# EAGLE design Ringlight (EAGLE 9.6.2)
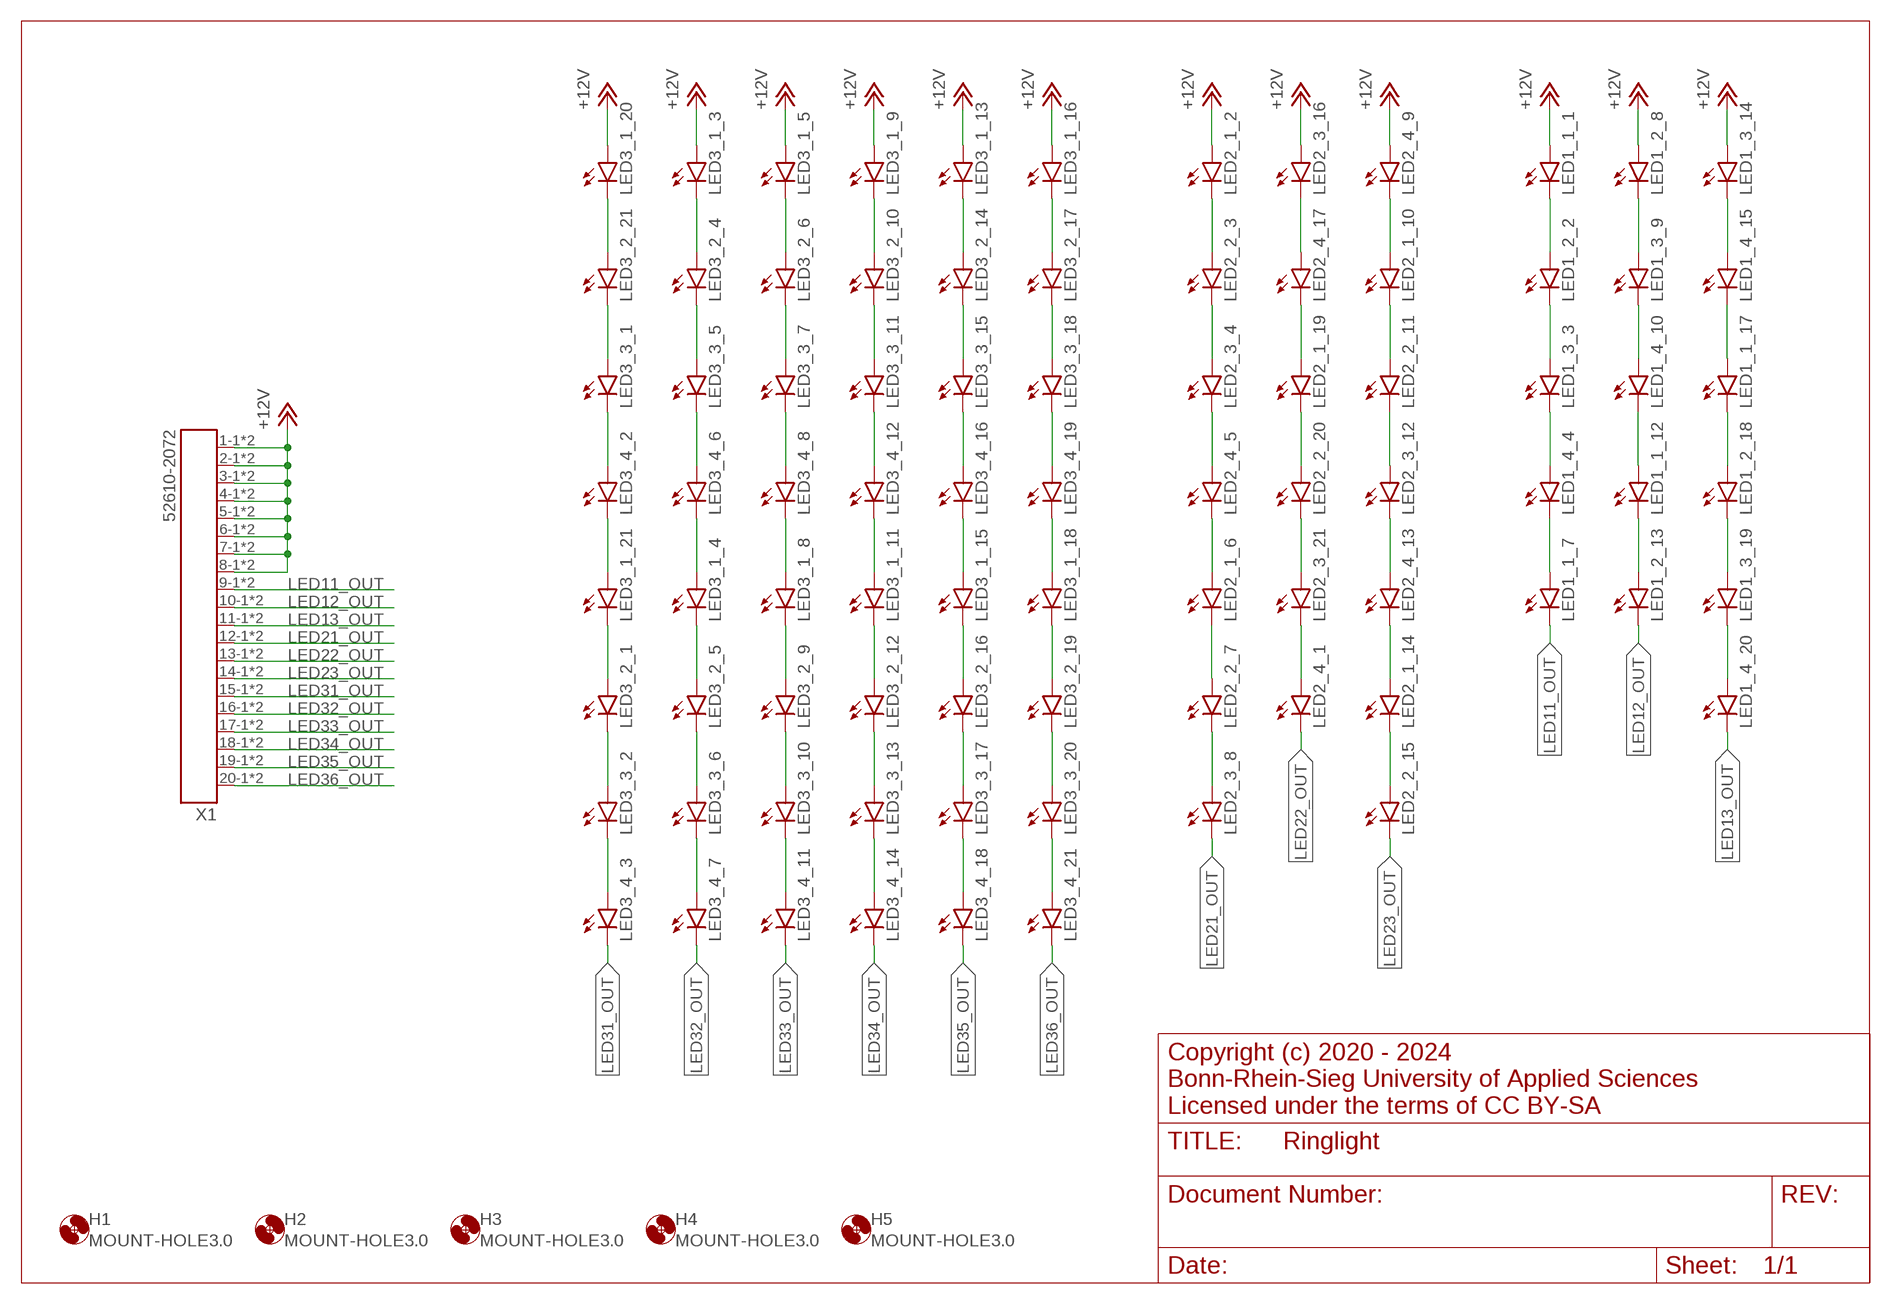
[diagram p0: schematic, sheet 1]

## Parts
H1  MOUNT-HOLE3.0  [3,0]
H2  MOUNT-HOLE3.0  [3,0]
H3  MOUNT-HOLE3.0  [3,0]
H4  MOUNT-HOLE3.0  [3,0]
H5  MOUNT-HOLE3.0  [3,0]
LED1_1_1  LED5MM  [LED5MM]
LED1_1_7  LED5MM  [LED5MM]
LED1_1_12  LED5MM  [LED5MM]
LED1_1_17  LED5MM  [LED5MM]
LED1_2_2  LED5MM  [LED5MM]
LED1_2_8  LED5MM  [LED5MM]
LED1_2_13  LED5MM  [LED5MM]
LED1_2_18  LED5MM  [LED5MM]
LED1_3_3  LED5MM  [LED5MM]
LED1_3_9  LED5MM  [LED5MM]
LED1_3_14  LED5MM  [LED5MM]
LED1_3_19  LED5MM  [LED5MM]
LED1_4_4  LED5MM  [LED5MM]
LED1_4_10  LED5MM  [LED5MM]
LED1_4_15  LED5MM  [LED5MM]
LED1_4_20  LED5MM  [LED5MM]
LED2_1_2  LED5MM  [LED5MM]
LED2_1_6  LED5MM  [LED5MM]
LED2_1_10  LED5MM  [LED5MM]
LED2_1_14  LED5MM  [LED5MM]
LED2_1_19  LED5MM  [LED5MM]
LED2_2_3  LED5MM  [LED5MM]
LED2_2_7  LED5MM  [LED5MM]
LED2_2_11  LED5MM  [LED5MM]
LED2_2_15  LED5MM  [LED5MM]
LED2_2_20  LED5MM  [LED5MM]
LED2_3_4  LED5MM  [LED5MM]
LED2_3_8  LED5MM  [LED5MM]
LED2_3_12  LED5MM  [LED5MM]
LED2_3_16  LED5MM  [LED5MM]
LED2_3_21  LED5MM  [LED5MM]
LED2_4_1  LED5MM  [LED5MM]
LED2_4_5  LED5MM  [LED5MM]
LED2_4_9  LED5MM  [LED5MM]
LED2_4_13  LED5MM  [LED5MM]
LED2_4_17  LED5MM  [LED5MM]
LED3_1_3  LED5MM  [LED5MM]
LED3_1_4  LED5MM  [LED5MM]
LED3_1_5  LED5MM  [LED5MM]
LED3_1_8  LED5MM  [LED5MM]
LED3_1_9  LED5MM  [LED5MM]
LED3_1_11  LED5MM  [LED5MM]
LED3_1_13  LED5MM  [LED5MM]
LED3_1_15  LED5MM  [LED5MM]
LED3_1_16  LED5MM  [LED5MM]
LED3_1_18  LED5MM  [LED5MM]
LED3_1_20  LED5MM  [LED5MM]
LED3_1_21  LED5MM  [LED5MM]
LED3_2_1  LED5MM  [LED5MM]
LED3_2_4  LED5MM  [LED5MM]
LED3_2_5  LED5MM  [LED5MM]
LED3_2_6  LED5MM  [LED5MM]
LED3_2_9  LED5MM  [LED5MM]
LED3_2_10  LED5MM  [LED5MM]
LED3_2_12  LED5MM  [LED5MM]
LED3_2_14  LED5MM  [LED5MM]
LED3_2_16  LED5MM  [LED5MM]
LED3_2_17  LED5MM  [LED5MM]
LED3_2_19  LED5MM  [LED5MM]
LED3_2_21  LED5MM  [LED5MM]
LED3_3_1  LED5MM  [LED5MM]
LED3_3_2  LED5MM  [LED5MM]
LED3_3_5  LED5MM  [LED5MM]
LED3_3_6  LED5MM  [LED5MM]
LED3_3_7  LED5MM  [LED5MM]
LED3_3_10  LED5MM  [LED5MM]
LED3_3_11  LED5MM  [LED5MM]
LED3_3_13  LED5MM  [LED5MM]
LED3_3_15  LED5MM  [LED5MM]
LED3_3_17  LED5MM  [LED5MM]
LED3_3_18  LED5MM  [LED5MM]
LED3_3_20  LED5MM  [LED5MM]
LED3_4_2  LED5MM  [LED5MM]
LED3_4_3  LED5MM  [LED5MM]
LED3_4_6  LED5MM  [LED5MM]
LED3_4_7  LED5MM  [LED5MM]
LED3_4_8  LED5MM  [LED5MM]
LED3_4_11  LED5MM  [LED5MM]
LED3_4_12  LED5MM  [LED5MM]
LED3_4_14  LED5MM  [LED5MM]
LED3_4_16  LED5MM  [LED5MM]
LED3_4_18  LED5MM  [LED5MM]
LED3_4_19  LED5MM  [LED5MM]
LED3_4_21  LED5MM  [LED5MM]
X1  52610-2072  [52610-2072]

## Nets
+12V: LED1_1_1.A LED1_2_8.A LED1_3_14.A LED2_1_2.A LED2_3_16.A LED2_4_9.A LED3_1_3.A LED3_1_5.A LED3_1_9.A LED3_1_13.A LED3_1_16.A LED3_1_20.A X1.1-1 X1.1-2 X1.2-1 X1.2-2 X1.3-1 X1.3-2 X1.4-1 X1.4-2 X1.5-1 X1.5-2 X1.6-1 X1.6-2 X1.7-1 X1.7-2 X1.8-1 X1.8-2
LED11_OUT: LED1_1_7.K(C) X1.9-1 X1.9-2
LED12_OUT: LED1_2_13.K(C) X1.10-1 X1.10-2
LED13_OUT: LED1_4_20.K(C) X1.11-1 X1.11-2
LED21_OUT: LED2_3_8.K(C) X1.12-1 X1.12-2
LED22_OUT: LED2_4_1.K(C) X1.13-1 X1.13-2
LED23_OUT: LED2_2_15.K(C) X1.14-1 X1.14-2
LED31_OUT: LED3_4_3.K(C) X1.15-1 X1.15-2
LED32_OUT: LED3_4_7.K(C) X1.16-1 X1.16-2
LED33_OUT: LED3_4_11.K(C) X1.17-1 X1.17-2
LED34_OUT: LED3_4_14.K(C) X1.18-1 X1.18-2
LED35_OUT: LED3_4_18.K(C) X1.19-1 X1.19-2
LED36_OUT: LED3_4_21.K(C) X1.20-1 X1.20-2
N$1: LED1_1_1.K(C) LED1_2_2.A
N$2: LED1_2_2.K(C) LED1_3_3.A
N$3: LED1_3_3.K(C) LED1_4_4.A
N$4: LED1_1_12.A LED1_4_10.K(C)
N$5: LED1_2_8.K(C) LED1_3_9.A
N$6: LED1_3_9.K(C) LED1_4_10.A
N$7: LED1_1_17.A LED1_4_15.K(C)
N$8: LED1_1_12.K(C) LED1_2_13.A
N$9: LED1_3_14.K(C) LED1_4_15.A
N$10: LED2_2_11.K(C) LED2_3_12.A
N$11: LED1_1_17.K(C) LED1_2_18.A
N$12: LED1_2_18.K(C) LED1_3_19.A
N$13: LED1_3_19.K(C) LED1_4_20.A
N$14: LED2_1_2.K(C) LED2_2_3.A
N$15: LED2_2_3.K(C) LED2_3_4.A
N$16: LED2_3_4.K(C) LED2_4_5.A
N$17: LED2_1_6.A LED2_4_5.K(C)
N$18: LED2_3_16.K(C) LED2_4_17.A
N$19: LED2_2_7.K(C) LED2_3_8.A
N$20: LED2_1_10.A LED2_4_9.K(C)
N$21: LED2_1_10.K(C) LED2_2_11.A
N$22: LED3_1_3.K(C) LED3_2_4.A
N$23: LED2_3_12.K(C) LED2_4_13.A
N$24: LED2_1_14.A LED2_4_13.K(C)
N$25: LED2_1_14.K(C) LED2_2_15.A
N$26: LED3_2_4.K(C) LED3_3_5.A
N$27: LED2_1_19.A LED2_4_17.K(C)
N$28: LED2_1_19.K(C) LED2_2_20.A
N$29: LED2_2_20.K(C) LED2_3_21.A
N$30: LED2_3_21.K(C) LED2_4_1.A
N$31: LED3_3_5.K(C) LED3_4_6.A
N$32: LED3_1_4.A LED3_4_6.K(C)
N$33: LED3_1_4.K(C) LED3_2_5.A
N$34: LED3_2_5.K(C) LED3_3_6.A
N$35: LED3_3_6.K(C) LED3_4_7.A
N$36: LED3_1_5.K(C) LED3_2_6.A
N$37: LED3_2_6.K(C) LED3_3_7.A
N$38: LED3_3_7.K(C) LED3_4_8.A
N$39: LED3_1_8.A LED3_4_8.K(C)
N$40: LED3_1_8.K(C) LED3_2_9.A
N$41: LED3_2_9.K(C) LED3_3_10.A
N$42: LED3_3_10.K(C) LED3_4_11.A
N$43: LED3_1_9.K(C) LED3_2_10.A
N$44: LED3_2_10.K(C) LED3_3_11.A
N$45: LED3_3_11.K(C) LED3_4_12.A
N$46: LED3_1_11.A LED3_4_12.K(C)
N$47: LED3_1_11.K(C) LED3_2_12.A
N$48: LED3_2_12.K(C) LED3_3_13.A
N$49: LED3_3_13.K(C) LED3_4_14.A
N$50: LED3_1_13.K(C) LED3_2_14.A
N$51: LED3_2_14.K(C) LED3_3_15.A
N$52: LED3_3_15.K(C) LED3_4_16.A
N$53: LED3_1_15.A LED3_4_16.K(C)
N$54: LED3_1_15.K(C) LED3_2_16.A
N$55: LED3_2_16.K(C) LED3_3_17.A
N$56: LED3_3_17.K(C) LED3_4_18.A
N$57: LED3_1_16.K(C) LED3_2_17.A
N$58: LED3_2_17.K(C) LED3_3_18.A
N$59: LED3_3_18.K(C) LED3_4_19.A
N$60: LED3_1_18.A LED3_4_19.K(C)
N$61: LED3_1_18.K(C) LED3_2_19.A
N$62: LED3_2_19.K(C) LED3_3_20.A
N$63: LED3_3_20.K(C) LED3_4_21.A
N$64: LED3_1_20.K(C) LED3_2_21.A
N$65: LED3_2_21.K(C) LED3_3_1.A
N$66: LED3_3_1.K(C) LED3_4_2.A
N$67: LED3_1_21.A LED3_4_2.K(C)
N$68: LED3_1_21.K(C) LED3_2_1.A
N$69: LED3_2_1.K(C) LED3_3_2.A
N$70: LED3_3_2.K(C) LED3_4_3.A
N$71: LED1_1_7.A LED1_4_4.K(C)
N$72: LED2_1_6.K(C) LED2_2_7.A

## Notes on the sheet
- Copyright (c) 2020 - 2024
  Bonn-Rhein-Sieg University of Applied Sciences
  Licensed under the terms of CC BY-SA

## Library data of the parts
H1-H5 = holes:MOUNT-HOLE: MOUNTING HOLE with drill center marker
LED1_1_1 LED1_1_7 LED1_1_12 LED1_1_17 LED1_2_2 LED1_2_8 LED1_2_13 LED1_2_18 LED1_3_3 LED1_3_9 LED1_3_14 LED1_3_19 LED1_4_4 LED1_4_10 LED1_4_15 LED1_4_20 LED2_1_2 LED2_1_6 LED2_1_10 LED2_1_14 LED2_1_19 LED2_2_3 LED2_2_7 LED2_2_11 LED2_2_15 LED2_2_20 LED2_3_4 LED2_3_8 LED2_3_12 LED2_3_16 LED2_3_21 LED2_4_1 LED2_4_5 LED2_4_9 LED2_4_13 LED2_4_17 LED3_1_3-LED3_1_5 LED3_1_8 LED3_1_9 LED3_1_11 LED3_1_13 LED3_1_15 LED3_1_16 LED3_1_18 LED3_1_20 LED3_1_21 LED3_2_1 LED3_2_4-LED3_2_6 LED3_2_9 LED3_2_10 LED3_2_12 LED3_2_14 LED3_2_16 LED3_2_17 LED3_2_19 LED3_2_21 LED3_3_1 LED3_3_2 LED3_3_5-LED3_3_7 LED3_3_10 LED3_3_11 LED3_3_13 LED3_3_15 LED3_3_17 LED3_3_18 LED3_3_20 LED3_4_2 LED3_4_3 LED3_4_6-LED3_4_8 LED3_4_11 LED3_4_12 LED3_4_14 LED3_4_16 LED3_4_18 LED3_4_19 LED3_4_21 = led:LED: LED OSRAM: - CHIPLED LG R971, LG N971, LY N971, LG Q971, LY Q971, LO R971, LY R971 LH N974, LH R974 LS Q976, LO Q976, LY Q976 LO Q996 - Hyper CHIPLED LW Q18S LB Q993, LB Q99A, LB R99A - SideLED LS A670, LO A670, LY A670, LG A670, LP A670 LB A673, LV A673, LT A673, LW A673 LH A674 LY A675 LS A676, LA A676, LO A676, LY A676, LW A676 LS A679, LY A679, LG A679 - Hyper Micro SIDELED® LS Y876, LA Y876, LO Y876, LY Y876 LT Y87S - SmartLED LW L88C, LW L88S LB L89C, LB L89S, LG L890 LS L89K, LO L89K, LY L89K LS L896, LA L896, LO L896, LY L896 - TOPLED LS T670, LO T670, LY T670, LG T670, LP T670 LSG T670, LSP T670, LSY T670, LOP T670, LYG T670 LG T671, LOG T671, LSG T671 LB T673, LV T673, LT T673, LW T673 LH T674 LS T676, LA T676, LO T676, LY T676, LB T676, LH T676, LSB T676, LW T676 LB T67C, LV T67C, LT T67C, LS T67K, LO T67K, LY T67K, LW E67C LS E67B, LA E67B, LO E67B, LY E67B, LB E67C, LV E67C, LT E67C LW T67C LS T679, LY T679, LG T679 LS T770, LO T770, LY T770, LG T770, LP T770 LB T773, LV T773, LT T773, LW T773 LH T774 LS E675, LA E675, LY E675, LS T675 LS T776, LA T776, LO T776, LY T776, LB T776 LHGB T686 LT T68C, LB T68C - Hyper Mini TOPLED® LB M676 - Mini TOPLED Santana® LG M470 LS M47K, LO M47K, LY M47K Source: http://www.osram.convergy.de LUXEON: - LUMILED® LXK2-PW12-R00, LXK2-PW12-S00, LXK2-PW14-U00, LXK2-PW14-V00 LXK2-PM12-R00, LXK2-PM12-S00, LXK2-PM14-U00 LXK2-PE12-Q00, LXK2-PE12-R00, LXK2-PE12-S00, LXK2-PE14-T00, LXK2-PE14-U00 LXK2-PB12-K00, LXK2-PB12-L00, LXK2-PB12-M00, LXK2-PB14-N00, LXK2-PB14-P00, LXK2-PB14-Q00 LXK2-PR12-L00, LXK2-PR12-M00, LXK2-PR14-Q00, LXK2-PR14-R00 LXK2-PD12-Q00, LXK2-PD12-R00, LXK2-PD12-S00 LXK2-PH12-R00, LXK2-PH12-S00 LXK2-PL12-P00, LXK2-PL12-Q00, LXK2-PL12-R00 Source: www.luxeon.com KINGBRIGHT: KA-3528ASYC Source: www.kingbright.com
X1 = Molex 52610-XX72:52610-2072

## Net classes
0 default: width 0.305 mm, clearance 0.305 mm

## Board
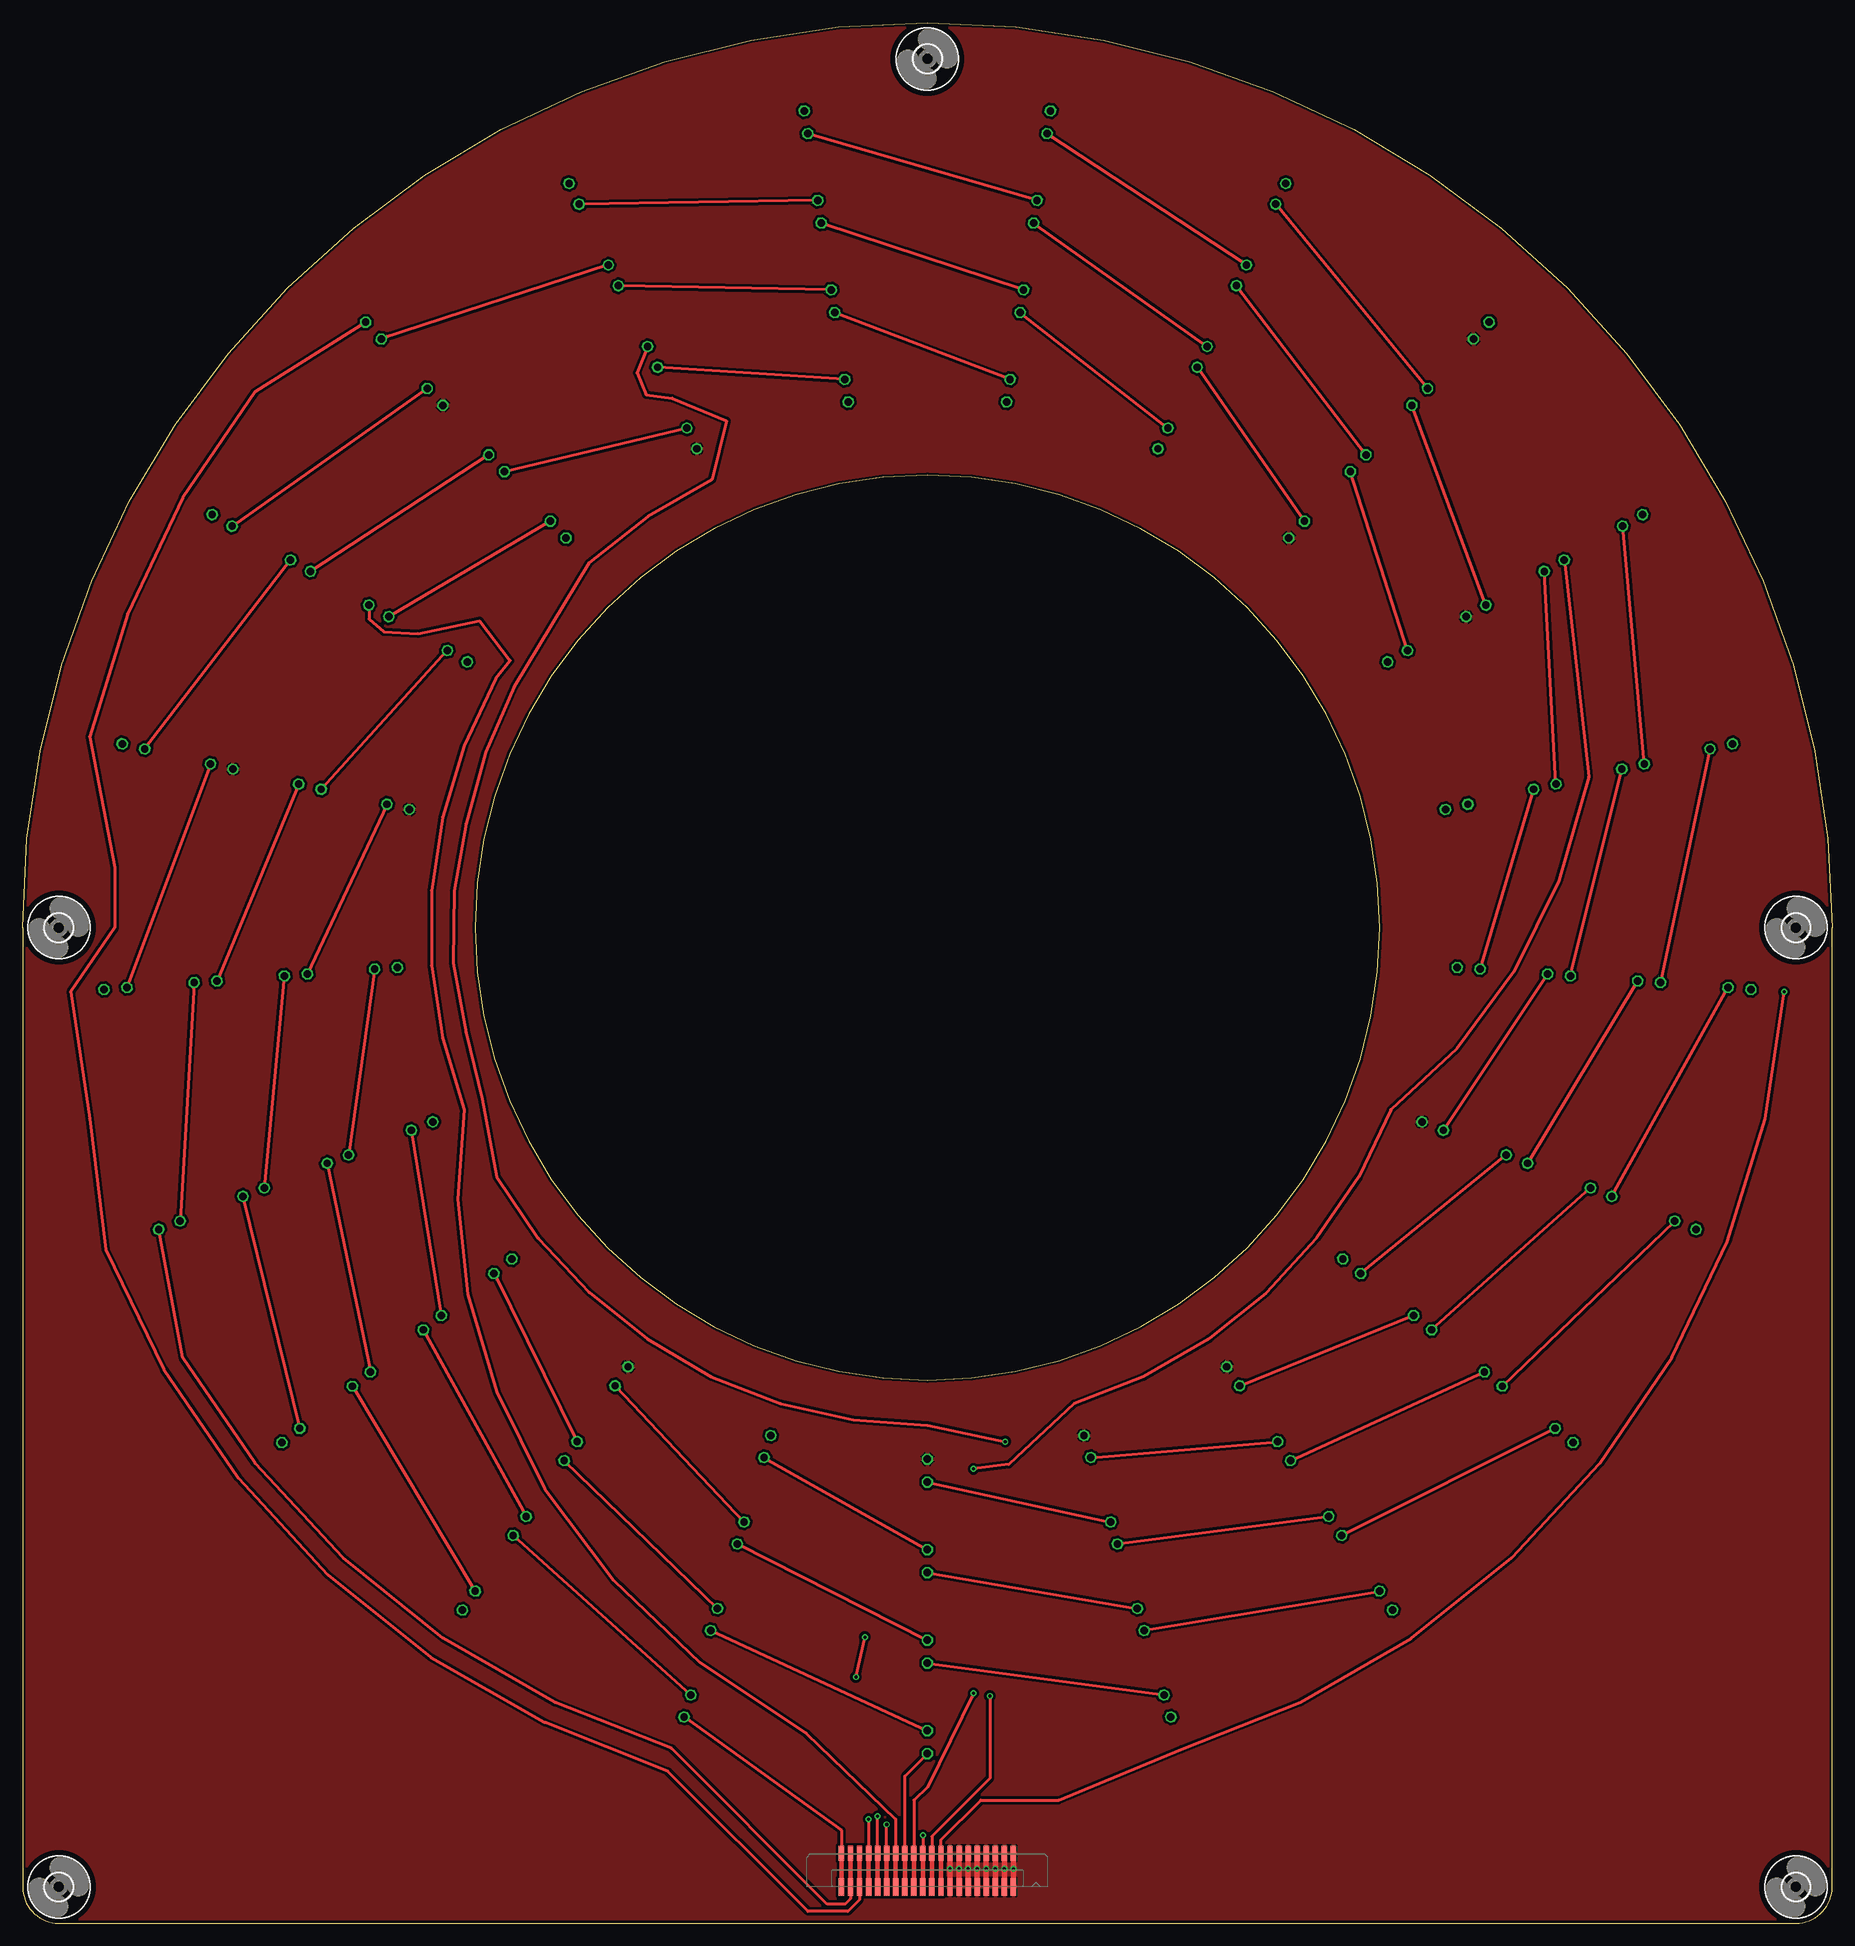
[diagram p1: board, top side]
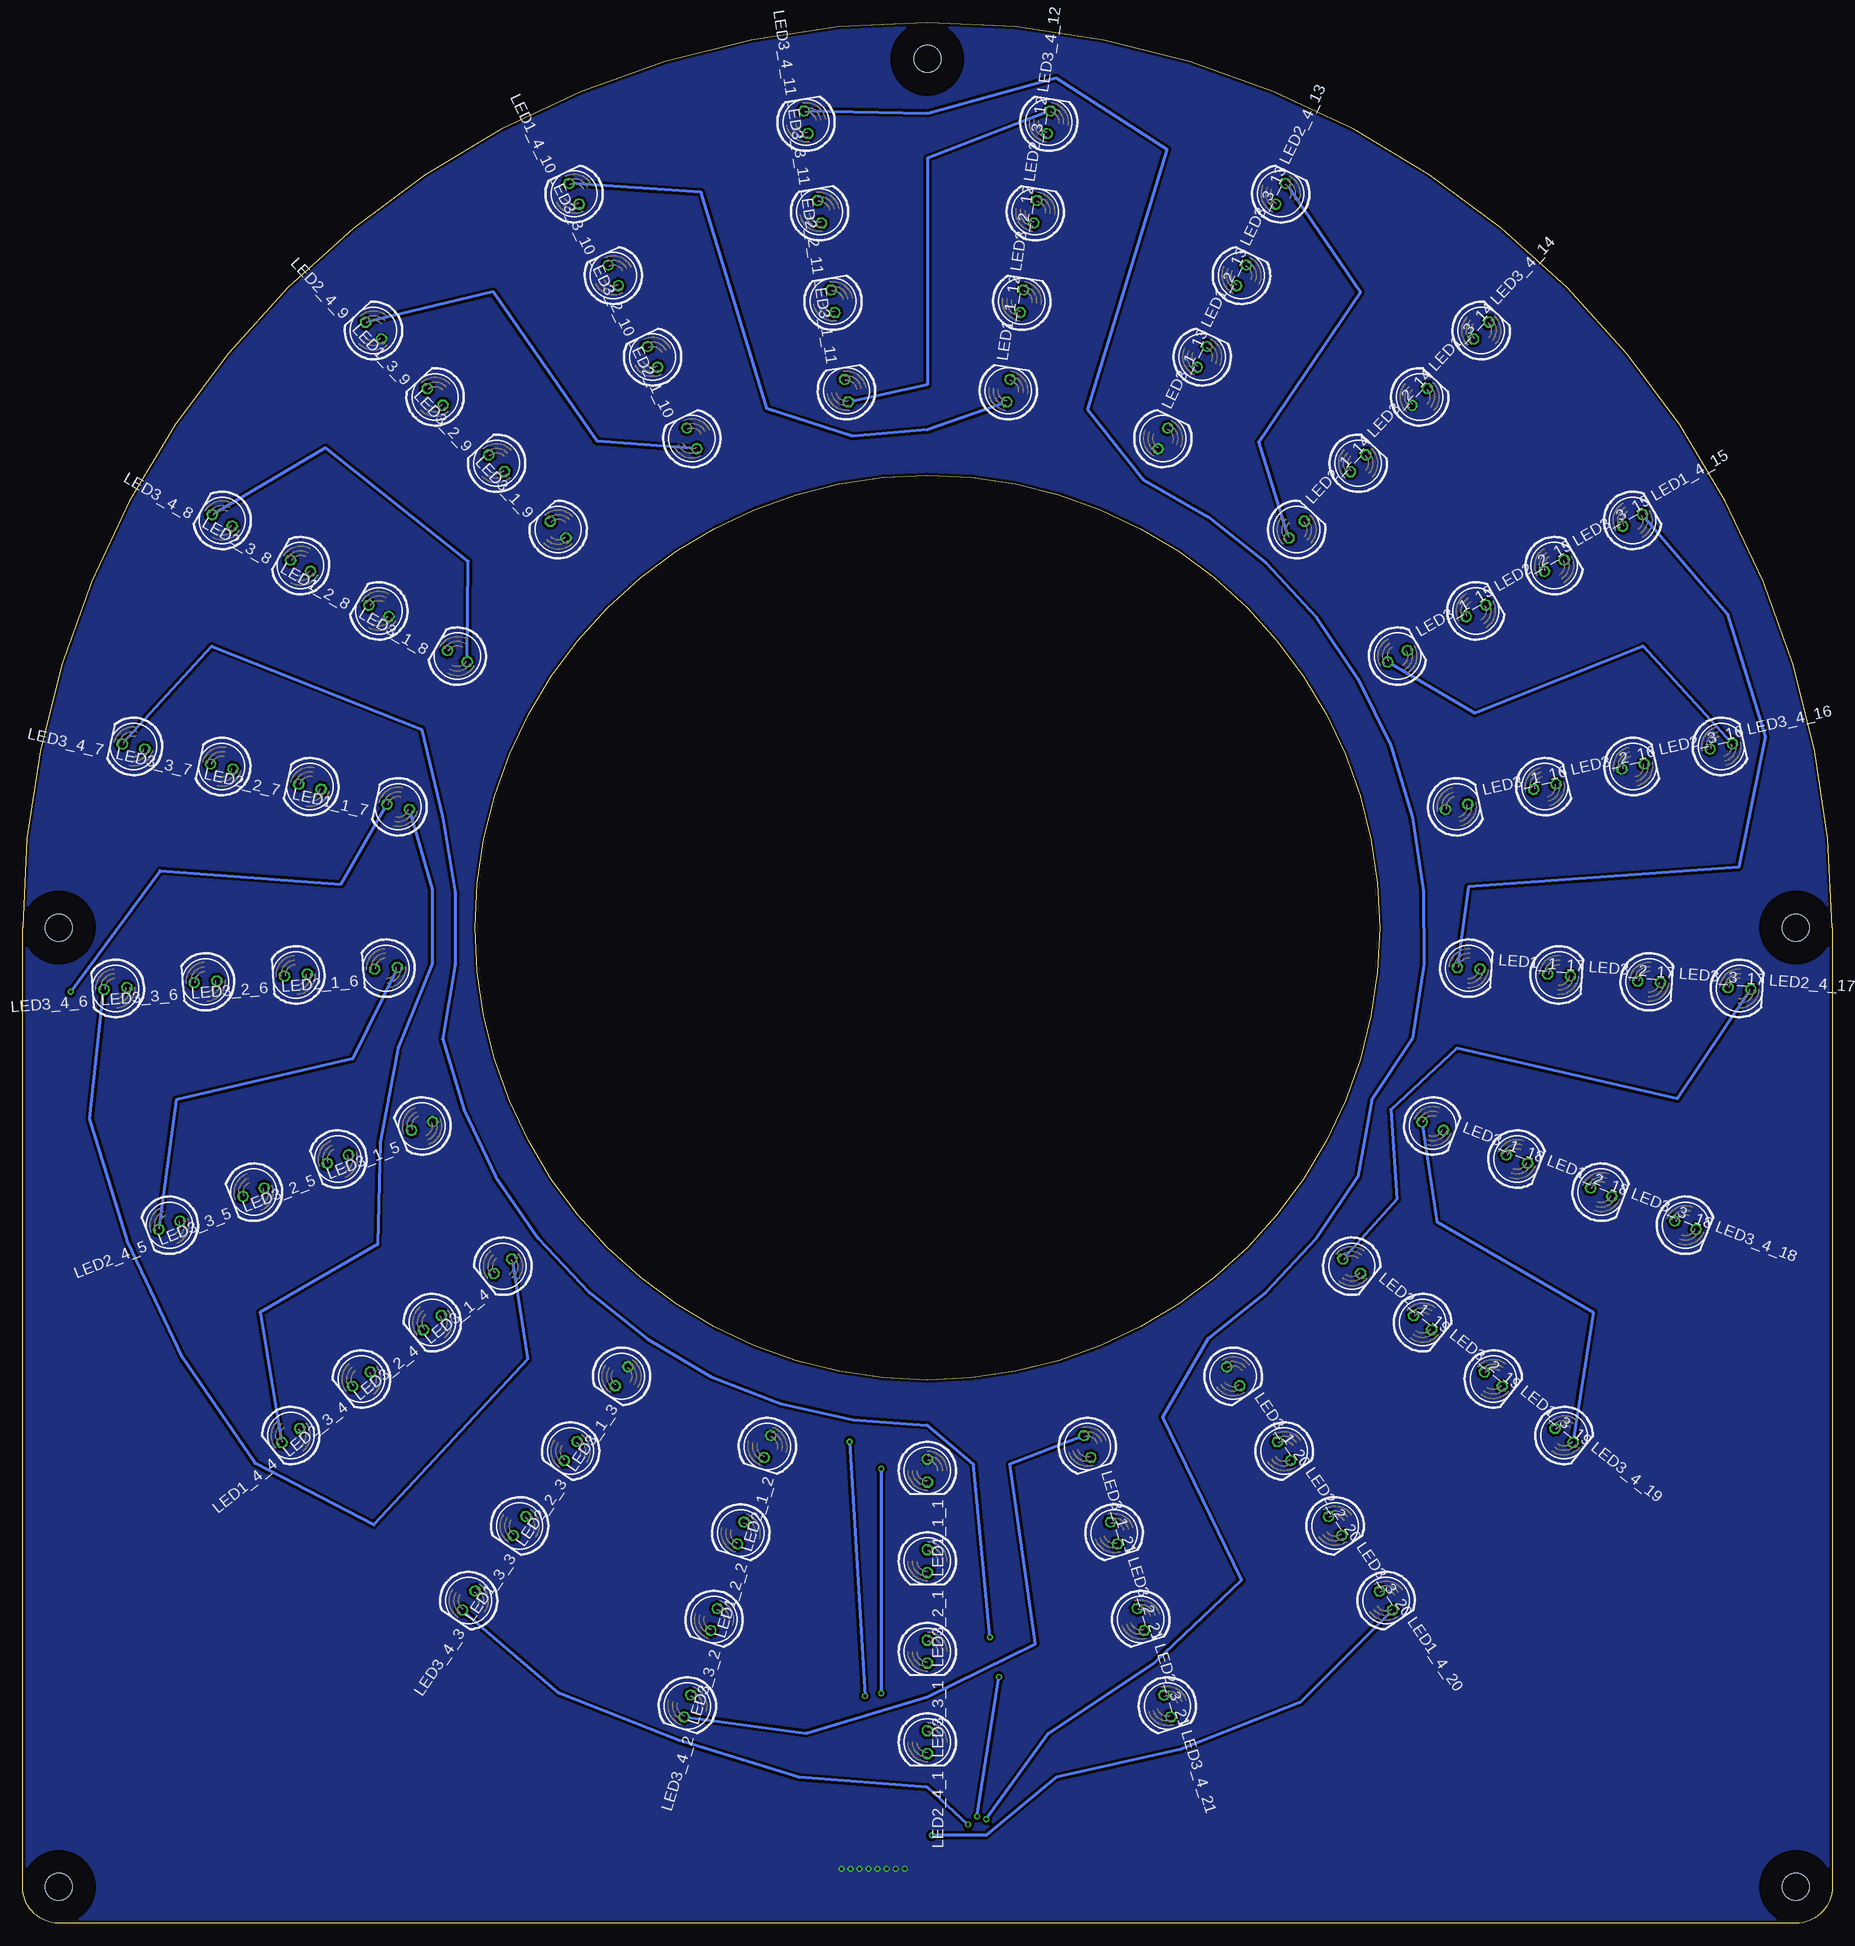
[diagram p2: board, bottom side, seen from below]

Size 200 x 210 mm. Coordinates in mm from the lower left corner, seen from the top.
Outline: 0,4 arc90 4,0 196,0 arc90 200,4 200,110 arc180 0,110 0,4
Outline: 150,110 arc180 50,110 arc180 150,110
Copper layers (1*16): Top 0.035mm / dielectric 1.5mm / Bottom 0.035mm
Design rules "PCB-POOL Standard": minimum track width 0.15mm, minimum drill 0.3mm, track to track 0.15mm, track to pad 0.15mm, pad to pad 0.15mm, via to via 0.15mm, smd to smd 0.15mm, copper to edge 0.3mm, drill to drill 0.2mm, minimum pad ring 0.2mm, minimum via ring 0.15mm, stop-mask expansion 0.075mm, vias tented up to drill 0mil, thermal gap 0.2mm

### Footprints (pad centres in the part's own frame; a part is rotated, then mirrored left to right if it is on the bottom)
3,0 = hole 3: 0,0
LED5MM = drill 0.813 octagon: A -1.27,0; K 1.27,0
52610-2072 = smd 0.6 x 1.9: 1-1 -9.5,0; 2-1 -8.5,0; 3-1 -7.5,0; 4-1 -6.5,0; 5-1 -5.5,0; 6-1 -4.5,0; 7-1 -3.5,0; 8-1 -2.5,0; 9-1 -1.5,0; 10-1 -0.5,0; 11-1 0.5,0; 12-1 1.5,0; 13-1 2.5,0; 14-1 3.5,0; 15-1 4.5,0; 16-1 5.5,0; 17-1 6.5,0; 18-1 7.5,0; 19-1 8.5,0; 20-1 9.5,0 | smd 0.6 x 1.65: 1-2 -9.5,-3.725; 2-2 -8.5,-3.725; 3-2 -7.5,-3.725; 4-2 -6.5,-3.725; 5-2 -5.5,-3.725; 6-2 -4.5,-3.725; 7-2 -3.5,-3.725; 8-2 -2.5,-3.725; 9-2 -1.5,-3.725; 10-2 -0.5,-3.725; 11-2 0.5,-3.725; 12-2 1.5,-3.725; 13-2 2.5,-3.725; 14-2 3.5,-3.725; 15-2 4.5,-3.725; 16-2 5.5,-3.725; 17-2 6.5,-3.725; 18-2 7.5,-3.725; 19-2 8.5,-3.725; 20-2 9.5,-3.725

### Placement (x,y rotation side)
H1  100,206 0 top
H2  196,110 0 top
H3  4,110 0 top
H4  196,4 0 top
H5  4,4 0 top
LED1_1_1  100,50 270 bottom
LED1_1_7  158.5,123.35 167.2 bottom
LED1_1_12  91.06,169.33 81.4 bottom
LED1_1_17  40.17,105.52 355.7 bottom
LED1_2_2  120.63,43.11 252.9 bottom
LED1_2_8  160.62,145 150 bottom
LED1_2_13  69.63,173.07 64.2 bottom
LED1_2_18  34.84,84.43 338.6 bottom
LED1_3_3  145.07,43.9 235.7 bottom
LED1_3_9  154.41,168.64 132.9 bottom
LED1_3_14  45.59,168.64 47.1 bottom
LED1_3_19  37.45,60.12 321.4 bottom
LED1_4_4  170.36,53.89 218.6 bottom
LED1_4_10  139.05,191.09 115.8 bottom
LED1_4_15  22.06,155 30 bottom
LED1_4_20  49.3,35.64 304.3 bottom
LED2_1_2  117.69,52.67 252.9 bottom
LED2_1_6  159.83,105.52 184.3 bottom
LED2_1_10  126.03,164.06 115.8 bottom
LED2_1_14  59.19,153.98 47.1 bottom
LED2_1_19  53.09,72.59 321.4 bottom
LED2_2_3  139.43,52.16 235.7 bottom
LED2_2_7  168.24,125.58 167.2 bottom
LED2_2_11  110.43,179.22 98.6 bottom
LED2_2_15  39.38,145 30 bottom
LED2_2_20  60.57,52.16 304.3 bottom
LED2_3_4  162.55,60.12 218.6 bottom
LED2_3_8  169.28,150 150 bottom
LED2_3_12  88.08,189.11 81.4 bottom
LED2_3_16  22.01,127.8 12.8 bottom
LED2_3_21  76.42,33.55 287.1 bottom
LED2_4_1  100,20 270 bottom
LED2_4_5  183.78,77.12 201.4 bottom
LED2_4_9  161.22,175.97 132.9 bottom
LED2_4_13  60.95,191.09 64.2 bottom
LED2_4_17  10.25,103.27 355.7 bottom
LED3_1_3  133.8,60.43 235.7 bottom
LED3_1_4  146.91,72.59 218.6 bottom
LED3_1_5  155.85,88.08 201.4 bottom
LED3_1_8  151.96,140 150 bottom
LED3_1_9  140.81,153.98 132.9 bottom
LED3_1_11  108.94,169.33 98.6 bottom
LED3_1_13  73.97,164.06 64.2 bottom
LED3_1_15  48.04,140 30 bottom
LED3_1_16  41.5,123.35 12.8 bottom
LED3_1_18  44.15,88.08 338.6 bottom
LED3_1_20  66.2,60.43 304.3 bottom
LED3_1_21  82.31,52.67 287.1 bottom
LED3_2_1  100,40 270 bottom
LED3_2_4  154.73,66.36 218.6 bottom
LED3_2_5  165.16,84.43 201.4 bottom
LED3_2_6  169.8,104.77 184.3 bottom
LED3_2_9  147.61,161.31 132.9 bottom
LED3_2_10  130.37,173.07 115.8 bottom
LED3_2_12  89.57,179.22 81.4 bottom
LED3_2_14  52.39,161.31 47.1 bottom
LED3_2_16  31.76,125.58 12.8 bottom
LED3_2_17  30.2,104.77 355.7 bottom
LED3_2_19  45.27,66.36 321.4 bottom
LED3_2_21  79.37,43.11 287.1 bottom
LED3_3_1  100,30 270 bottom
LED3_3_2  123.58,33.55 252.9 bottom
LED3_3_5  174.47,80.77 201.4 bottom
LED3_3_6  179.78,104.02 184.3 bottom
LED3_3_7  177.99,127.8 167.2 bottom
LED3_3_10  134.71,182.08 115.8 bottom
LED3_3_11  111.92,189.11 98.6 bottom
LED3_3_13  65.29,182.08 64.2 bottom
LED3_3_15  30.72,150 30 bottom
LED3_3_17  20.22,104.02 355.7 bottom
LED3_3_18  25.53,80.77 338.6 bottom
LED3_3_20  54.93,43.9 304.3 bottom
LED3_4_2  126.53,24 252.9 bottom
LED3_4_3  150.7,35.64 235.7 bottom
LED3_4_6  189.75,103.27 184.3 bottom
LED3_4_7  187.74,130.03 167.2 bottom
LED3_4_8  177.94,155 150 bottom
LED3_4_11  113.41,198.99 98.6 bottom
LED3_4_12  86.59,198.99 81.4 bottom
LED3_4_14  38.78,175.97 47.1 bottom
LED3_4_16  12.26,130.03 12.8 bottom
LED3_4_18  16.22,77.12 338.6 bottom
LED3_4_19  29.64,53.89 321.4 bottom
LED3_4_21  73.47,24 287.1 bottom
X1  100,4 180 top

### Tracks (layer width: path | path; a pad name or v marks a point on that pad's centre or on a via)
+12V  (via drill 0.35)
  Top 0.61: X1.1-2 X1.1-1 | X1.2-1 X1.2-2 | X1.3-2 X1.3-1 | X1.4-1 X1.4-2 | X1.5-2 X1.5-1 | X1.6-1 X1.6-2 | X1.7-2 X1.7-1 | X1.8-1 X1.8-2
  other vias: 109.5,6 108.5,6 107.5,6 106.5,6 105.5,6 104.5,6 103.5,6 102.5,6
  pour Bottom: 0,4 arc90 4,0 196,0 arc90 200,4 200,110 arc180 0,110
  pour Top (rank 2): 0,110 0,4 arc90 4,0 196,0 arc90 200,4 200,110 arc180
  cutout Top: 50,110 arc-90 100,160 arc-90 150,110 arc-90 100,60 arc-90
  cutout Bottom: 50,110 arc-90 100,160 arc-90 150,110 arc-90 100,60 arc-90
LED11_OUT  (via drill 0.35)
  Top 0.305: v194.7,102.9 192.6,88.9 188.4,75.3 182.3,62.5 174.3,50.8 164.6,40.4 153.5,31.5 141.2,24.4 128.1,19.2 114.5,13.6 105.9,13.6 101.5,9.2 X1.9-2
  Top 0.508: X1.9-2 X1.9-1
  Bottom 0.305: v194.7,102.9 184.8,116.3 164.8,114.8 LED1_1_7.K
LED12_OUT  (via drill 0.35)
  Top 0.305: LED1_2_13.K 67.9,171.3 68.9,168.9 71.8,168.5 77.8,166 76.2,159.5 69.1,155.4 62.6,150.3 54.3,136.6 51.2,129.4 49,121.5 47.7,114 47.6,106.1 49,98.4 50.8,91.1 52.4,82.5 57,75.7 62.6,69.7 69,64.6 76.1,60.4 83.8,57.4 91.8,55.6 100,55 v108.6,53.2 | v106.9,25.1 106.9,16 100.5,9.6 X1.10-2
  Top 0.508: X1.10-2 X1.10-1
  Bottom 0.305: v108.6,53.2 v106.9,25.1
LED13_OUT  (via drill 0.35)
  Top 0.305: v99.5,9.7 X1.11-2
  Top 0.508: X1.11-2 X1.11-1
  Bottom 0.305: LED1_4_20.K 58.8,24.4 72,19.2 85.8,16.1 93.5,9.7 v99.5,9.7
LED21_OUT  (via drill 0.35)
  Top 0.305: LED2_3_8.K 173.1,126.7 169.8,115.2 164.8,105.1 158.5,96.6 151.2,89.9 147.7,82.5 143,75.7 137.4,69.6 131.18,64.65 131.04,64.5 123.9,60.4 116.2,57.4 109,50.7 v105.1,50.2 | v105.1,25.4 100,15 98.5,13.6 X1.12-2
  Top 0.508: X1.12-2 X1.12-1
  Bottom 0.305: v105.1,50.2 v105.1,25.4
LED22_OUT
  Top 0.305: X1.13-2 97.5,16.25 97.51,16.24 LED2_4_1.K
  Top 0.508: X1.13-2 X1.13-1
LED23_OUT
  Top 0.305: X1.14-2 96.5,11.5 86.6,21 74.9,28.8 65.3,37.9 57.7,48 52.4,58.7 49.2,69.5 48.1,80 48.8,89.9 46.4,97.8 45.2,105.8 45.2,114.1 46.4,122.2 48.8,130.1 52.3,137.5 53.9,139.5 50.5,143.9 43.7,142.5 39.9,142.7 38.3,144.1 LED2_2_15.K
  Top 0.508: X1.14-2 X1.14-1
LED31_OUT  (via drill 0.35)
  Top 0.305: X1.15-2 v95.5,10.9
  Top 0.508: X1.15-2 X1.15-1
  Bottom 0.305: v95.5,10.9 100,15 114.2,16.1 127.5,20.2 140.7,25.4 LED3_4_3.K
LED32_OUT  (via drill 0.35)
  Top 0.305: X1.16-2 v94.5,11.8 | v92.1,27.2 v93.1,31.6
  Top 0.508: X1.16-2 X1.16-1
  Bottom 0.305: LED3_4_7.K 179.1,141.1 155.9,131.9 153.6,122.2 152.2,113.9 152.2,105.9 153.6,97.7 151.2,89.8 147.7,82.5 143,75.7 137.4,69.7 131,64.6 123.9,60.4 116.2,57.4 108.2,55.6 100.11,55.01 100,55 94.9,50.7 v93.1,31.6 | v94.5,11.8 v92.1,27.2
LED33_OUT  (via drill 0.35)
  Top 0.305: v93.5,11.5 X1.17-2
  Top 0.508: X1.17-2 X1.17-1
  Bottom 0.305: LED3_4_11.K 100,200 85.8,203.9 73.5,196 82.3,167.3 76.1,159.5 69,155.4 62.6,150.3 57,144.3 52.4,137.5 48.8,130.1 46.4,122.2 45.2,114.1 45.1,105.9 46.4,97.7 50.9,91 52.4,82.5 57,75.7 62.6,69.7 69,64.6 74,55.9 65.3,37.9 74.9,28.8 86.6,21 v93.5,11.5
LED34_OUT
  Top 0.305: LED3_4_14.K 25.7,169.2 17.7,157.5 11.6,144.7 7.4,131.1 10.2,116.7 10.2,110 5.3,102.9 7.4,88.9 9.2,74.4 15.6,61.2 23.8,49.2 33.7,38.5 45.1,29.4 57.7,22.2 71.3,16.8 86.8,1.3 91.2,1.3 92.5,2.6 X1.18-1
  Top 0.508: X1.18-2 X1.18-1
LED35_OUT
  Top 0.305: X1.19-1 91.5,2.7 90.9,2.1 88.93,2.1 71.71,19.32 58.8,24.4 46.5,31.5 35.4,40.4 25.7,50.8 17.7,62.5 LED3_4_18.K
  Top 0.508: X1.19-2 X1.19-1
LED36_OUT
  Top 0.305: LED3_4_21.K 90.5,10.25 X1.20-2
  Top 0.508: X1.20-2 X1.20-1
N$1
  Top 0.305: LED1_1_1.K LED1_2_2.A
N$2
  Top 0.305: LED1_2_2.K LED1_3_3.A
N$3
  Top 0.305: LED1_3_3.K LED1_4_4.A
N$4
  Bottom 0.305: LED1_1_12.A 100,165 108.25,164.3 117.75,167.35 125,191.25 LED1_4_10.K
N$5
  Top 0.305: LED1_2_8.K LED1_3_9.A
N$6
  Top 0.305: LED1_3_9.K LED1_4_10.A
N$7
  Bottom 0.305: LED1_4_15.K 11.6,144.7 7.4,131.1 10.3,116.7 40.2,114.5 LED1_1_17.A
N$8
  Top 0.305: LED1_1_12.K LED1_2_13.A
N$9
  Top 0.305: LED1_3_14.K LED1_4_15.A
N$10
  Top 0.305: LED2_2_11.K LED2_3_12.A
N$11
  Top 0.305: LED1_1_17.K LED1_2_18.A
N$12
  Top 0.305: LED1_2_18.K LED1_3_19.A
N$13
  Top 0.305: LED1_3_19.K LED1_4_20.A
N$14
  Top 0.305: LED2_1_2.K LED2_2_3.A
N$15
  Top 0.305: LED2_2_3.K LED2_3_4.A
N$16
  Top 0.305: LED2_3_4.K LED2_4_5.A
N$17
  Bottom 0.305: LED2_1_6.A 163.5,95.5 183,91 LED2_4_5.K
N$18
  Top 0.305: LED2_3_16.K LED2_4_17.A
N$19
  Top 0.305: LED2_2_7.K LED2_3_8.A
N$20
  Bottom 0.305: LED2_1_10.A 136.5,163.75 148,180.25 LED2_4_9.K
N$21
  Top 0.305: LED2_1_10.K LED2_2_11.A
N$22
  Top 0.305: LED3_1_3.K LED3_2_4.A
N$23
  Top 0.305: LED2_3_12.K LED2_4_13.A
N$24
  Bottom 0.305: LED2_1_14.A 63.38,163.71 52.12,180.23 LED2_4_13.K
N$25
  Top 0.305: LED2_1_14.K LED2_2_15.A
N$26
  Top 0.305: LED3_2_4.K LED3_3_5.A
N$27
  Bottom 0.305: LED2_4_17.K 17.1,91.1 41.5,96.7 48.8,89.9 48.1,80 LED2_1_19.A
N$28
  Top 0.305: LED2_1_19.K LED2_2_20.A
N$29
  Top 0.305: LED2_2_20.K LED2_3_21.A
N$30
  Top 0.305: LED2_3_21.K LED2_4_1.A
N$31
  Top 0.305: LED3_3_5.K LED3_4_6.A
N$32
  Bottom 0.305: LED3_1_4.A 144.2,62.3 161.2,44 174.3,50.8 182.3,62.5 188.4,75.3 192.6,88.9 LED3_4_6.K
N$33
  Top 0.305: LED3_1_4.K LED3_2_5.A
N$34
  Top 0.305: LED3_2_5.K LED3_3_6.A
N$35
  Top 0.305: LED3_3_6.K LED3_4_7.A
N$36
  Top 0.305: LED3_1_5.K LED3_2_6.A
N$37
  Top 0.305: LED3_2_6.K LED3_3_7.A
N$38
  Top 0.305: LED3_3_7.K LED3_4_8.A
N$39
  Bottom 0.305: LED3_1_8.A 150.75,150.5 166.5,163 LED3_4_8.K
N$40
  Top 0.305: LED3_1_8.K LED3_2_9.A
N$41
  Top 0.305: LED3_3_10.A LED3_2_9.K
N$42
  Top 0.305: LED3_3_10.K LED3_4_11.A
N$43
  Top 0.305: LED3_1_9.K LED3_2_10.A
N$44
  Top 0.305: LED3_2_10.K LED3_3_11.A
N$45
  Top 0.305: LED3_3_11.K LED3_4_12.A
N$46
  Bottom 0.305: LED3_4_12.K 100,195 100,170 LED3_1_11.A
N$47
  Top 0.305: LED3_1_11.K LED3_2_12.A
N$48
  Top 0.305: LED3_2_12.K LED3_3_13.A
N$49
  Top 0.305: LED3_3_13.K LED3_4_14.A
N$50
  Top 0.305: LED3_1_13.K LED3_2_14.A
N$51
  Top 0.305: LED3_2_14.K LED3_3_15.A
N$52
  Top 0.305: LED3_3_15.K LED3_4_16.A
N$53
  Bottom 0.305: LED3_4_16.K 20.9,141.1 39.5,133.7 LED3_1_15.A
N$54
  Top 0.305: LED3_1_15.K LED3_2_16.A
N$55
  Top 0.305: LED3_2_16.K LED3_3_17.A
N$56
  Top 0.305: LED3_3_17.K LED3_4_18.A
N$57
  Top 0.305: LED3_1_16.K LED3_2_17.A
N$58
  Top 0.305: LED3_2_17.K LED3_3_18.A
N$59
  Top 0.305: LED3_3_18.K LED3_4_19.A
N$60
  Bottom 0.305: LED3_1_18.A 43.7,77.5 26.4,67.5 LED3_4_19.K
N$61
  Top 0.305: LED3_1_18.K LED3_2_19.A
N$62
  Top 0.305: LED3_2_19.K LED3_3_20.A
N$63
  Top 0.305: LED3_3_20.K LED3_4_21.A
N$64
  Top 0.305: LED3_1_20.K LED3_2_21.A
N$65
  Top 0.305: LED3_2_21.K LED3_3_1.A
N$66
  Top 0.305: LED3_3_1.K LED3_4_2.A
N$67
  Bottom 0.305: LED3_1_21.A 90.9,50.73 88.08,30.89 100,25 113.4,21 LED3_4_2.K
N$68
  Top 0.305: LED3_1_21.K LED3_2_1.A
N$69
  Top 0.305: LED3_2_1.K LED3_3_2.A
N$70
  Top 0.305: LED3_3_2.K LED3_4_3.A
N$71
  Bottom 0.305: LED1_1_7.A 154.75,114.25 154.75,106 158.5,96.75 160.5,86.25 160.75,75 173.75,67.5 LED1_4_4.K
N$72
  Top 0.305: LED2_1_6.K LED2_2_7.A

### Text on the board
tStop: Hochschule / Bonn-Rhein-Sieg | SkinCam: Ringlight 1.0 | Institut für / Sicherheitsforschung | Marcel Hasler, 2021
tDocu: 12 | 11 | 13 | 10 | 9 | 14 | 15 | 8 | 16 | 7 | 17 | 6 | 18 | 5 | 19 | 4 | 20 | 3 | 21 | 2 | 1